# Altium schematic sheet P1.schdoc
size 297 x 209 mm; Symbol: Drawing-Symbol_A4; @Project Name: nfc card; @Page Count: 1; @Update Date: 2026-07-08; @Create Date: 2026-07-08; @Schematic Name: Schematic1; @Page No: 1; @Page Name: P1; Company: EasyEDA.com; Version: V1.0; Page Size: A4; Device: Drawing-Symbol_A4; @Create Time: 15:09:24; @Update Time: 15:09:24; Border: 1; Width: 1170; Height: 825; Region Start: 1; X Region Count: 6; Y Region Count: 4; Blade Width: 10; Title Block Position: 3; @Board Name: Board1
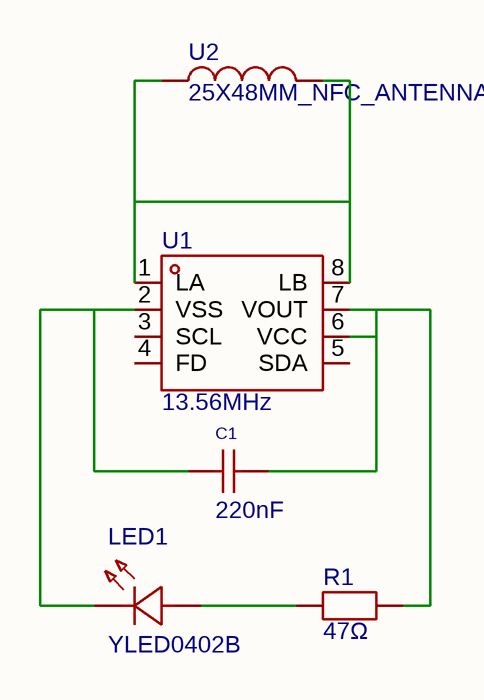
[diagram p0: P1.schdoc]

## Parts
C1  220nF  [C0201]
LED1  YLED0402B  [LED0402-RD]
R1  47Ω  [R0402]
U1  13.56MHz  [XQFN-8_L1.6-W1.6-P0.50-BL_NT3H2111W0FHKH]
U2  25X48MM_NFC_ANTENNA  [25X48MM_NFC_ANTENNA]

## Nets
NetC1_1: C1.1 LED1.1(K) U1.2(VSS)
NetC1_2: C1.2 R1.2 U1.6(VCC) U1.7(VOUT)
NetLED1_2: LED1.2(A) R1.1
NetU1_1: U1.1(LA) U1.8(LB) U2.P$1 U2.P$2

Not connected (* = marked no-connect by the designer): U1 3(SCL) 4(FD) 5(SDA)

## Notes on the sheet
- Create at
- 2026-07-08
- Schematic
- Board
- Schematic1
- Board1
- Update at
- Page
- P1
- Drawn
- Reviewed
- nfc card
- Version
- V1.0
- Size
- A4
- Page  1  Total  1
- EasyEDA.com

## Library data of the parts
C1 = GRM033R60J224ME15D: Capacitance:220nF Tolerance:±20% Tolerance:±20% Voltage Rating:6.3V Temperature Coefficient:X5R; Manufacturer: muRata(村田); AddInBom: yes; ModelId: c3e75c3d90204c70b153866ab54c789f0819f05c4eef4c71ace90d822a990e87; ModelName: C0201_L0.6-W0.3-H0.3; ModelTransform: 23.622,11.811,0,0,0,0,0,0,0; Tolerance: ±20%; Voltage Rating: 6.3V; Temperature Coefficient: X5R; Symbol: GRM033R60J224ME15D; Device: GRM033R60J224ME15D; Supplier: LCSC; Manufacturer Part: GRM033R60J224ME15D; Value: 220nF; Supplier Part: C76932; JLCPCB Part Class: Extended Part; LCSC Part Name: 220nF ±20% 6.3V; Supplier Footprint: 0201; Datasheet: https://item.szlcsc.com/datasheet/GRM033R60J224ME15D/78059.html; ConvertToPcb: yes; FootprintName: C0201
LED1 = YLED0402B: Lamp Holder Type:- Illumination Color:Blue Voltage - Forward(Vf):2.6V~3.1V Voltage - Forward(Vf):2.6V~3.1V Power(Watts):100mW Forward Current:20mA Wavelength - Dominant:460nm~475nm Wavelength - Dominant:460nm~475nm Peak Wavelength:469nm Peak Wavelength:46; Manufacturer: YONGYUTAI(永裕泰); AddInBom: yes; ModelId: b6291e20d463426285984a29308bda210819f05c4eef4c71ace90d822a990e87; ModelName: LED0402_L1.0-W0.5-H0.2; ModelTransform: 40.1574,19.685,0,0,0,0,0,-0.0005,0; Illumination Color: Blue; Power(Watts): 100mW; Forward Current: 20mA; Peak Wavelength: 469nm; Diode Configuration: Discrete Diode; Lens Color: Water Clear; Luminous Intensity: 100mcd; Viewing Angle: 120°; Symbol: YLED0402B; Device: YLED0402B; LCSC Part Name: 发光管; SupplierPart: C30584803; ManufacturerPart: YLED0402B; Supplier Footprint: 0402; JLCPCB Part Class: Extended Part; Datasheet: https://item.szlcsc.com/datasheet/YLED0402B/32319015.html; Supplier: LCSC; ConvertToPcb: yes; FootprintName: LED0402-RD; Lamp Holder Type: -; Voltage - Forward(Vf): 2.6V~3.1V; Wavelength - Dominant: 460nm~475nm; Color Temperature: -; Mounting Style: -; Operating Temperature: -40℃~+85℃
R1 = FRC0402F47R0TS: Type:Thick Film Resistor Resistance:47Ω Tolerance:±1% Tolerance:±1% Power(Watts):62.5mW Voltage-Supply(Max):50V Temperature Coefficient:±100ppm/℃ Temperature Coefficient:±100ppm/℃ Operating Temperature:-55℃~+155℃ Operating Temperature:-55℃~+155℃; Manufacturer: FOJAN(富捷); AddInBom: yes; ModelId: efdecb7dae4442949d28eecaf748420f0819f05c4eef4c71ace90d822a990e87; ModelName: R0402_L1.0-W0.5-H0.4; ModelTransform: 39.37,19.685,0,0,0,0,0,0,0; Tolerance: ±1%; Power(Watts): 62.5mW; Voltage-Supply(Max): 50V; Symbol: FRC0402F47R0TS; Device: FRC0402F47R0TS; LCSC Part Name: 47Ω ±1% 62.5mW 厚膜电阻; SupplierPart: C2909362; ManufacturerPart: FRC0402F47R0TS; Supplier Footprint: 0402; JLCPCB Part Class: Extended Part; Supplier: LCSC; ConvertToPcb: yes; FootprintName: R0402; Type: Thick Film Resistor; Value: 47Ω; Temperature Coefficient: ±100ppm/℃; Operating Temperature: -55℃~+155℃
U1 = NT3H2111W0FHKH: agreement:ISO 14443 interface type:I2C Frequency:13.56MHz Frequency:13.56MHz mains input:3.3V mains input:3.3V; Manufacturer: NXP(恩智浦); AddInBom: yes; interface type: I2C; mains input: 3.3V; Symbol: NT3H2111W0FHKH; Device: NT3H2111W0FHKH; LCSC Part Name: NT3H2111W0FHKH; SupplierPart: C710403; ManufacturerPart: NT3H2111W0FHKH; Supplier Footprint: XQFN-8(1.6x1.6); JLCPCB Part Class: Extended Part; Datasheet: https://www.nxp.com/docs/en/data-sheet/NT3H2111_2211.pdf; Supplier: LCSC; ConvertToPcb: yes; FootprintName: XQFN-8_L1.6-W1.6-P0.50-BL_NT3H2111W0FHKH; agreement: ISO 14443; Value: 13.56MHz
U2 = 25X48MM_NFC_ANTENNA: AddInBom: yes; Symbol: 25X48MM_NFC_ANTENNA; Device: 25X48MM_NFC_ANTENNA; ConvertToPcb: yes; FootprintName: 25X48MM_NFC_ANTENNA